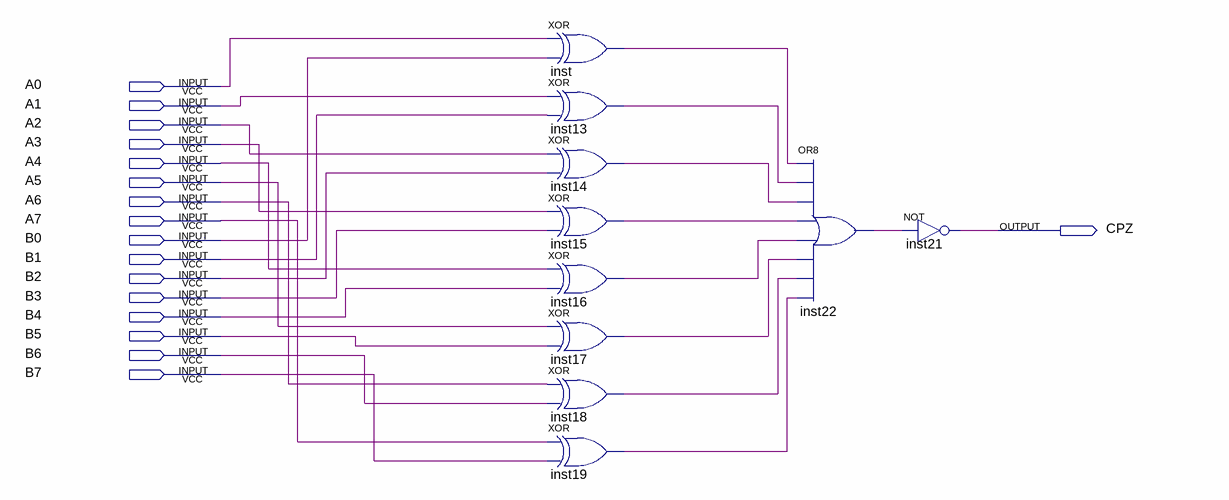
[diagram p0: schematic sheet]
// Quartus schematic My_8_bit_judge.bdf as structural Verilog: 10 symbols, 17 pins
module My_8_bit_judge (
  input  A0,
  input  A1,
  input  A2,
  input  A3,
  input  A4,
  input  A5,
  input  A6,
  input  A7,
  input  B0,
  input  B1,
  input  B2,
  input  B3,
  input  B4,
  input  B5,
  input  B6,
  input  B7,
  output CPZ
);

  wire inst13_out, inst14_out, inst15_out, inst16_out, inst17_out, inst18_out, inst19_out, inst22_out,
       inst_out;

  xor inst (inst_out, A0, B0);
  xor inst13 (inst13_out, A1, B1);
  xor inst14 (inst14_out, A2, B2);
  xor inst15 (inst15_out, A3, B3);
  xor inst16 (inst16_out, A4, B4);
  xor inst17 (inst17_out, A5, B5);
  xor inst18 (inst18_out, A6, B6);
  xor inst19 (inst19_out, A7, B7);
  or inst22 (inst22_out, inst_out, inst13_out, inst14_out, inst15_out, inst16_out, inst17_out, inst18_out, inst19_out);
  not inst21 (CPZ, inst22_out);
endmodule
